# Altium schematic sheet 2 power.SchDoc: =GlobalProjectName
size A4; DocumentNumber: 2; SheetNumber: 2; SheetTotal: 5; PageSetup: Record=PageOptions|CenterHorizontal=True|CenterVertical=True|PrintScale=1.00|XCorrection=1.00|YCorrection=1.00|PrintKind=1|BorderSize=5000000|LeftOffset=0|BottomOffset=0|Orientation=2|PaperLength=1000|PaperWidth=1000|Scale=100|PaperSource=15|PrintQuality=1200|MediaType=1|DitherType=10|PaperKind=A3|PrintScaleMode=1; Weight: -; ScaleFactor: -
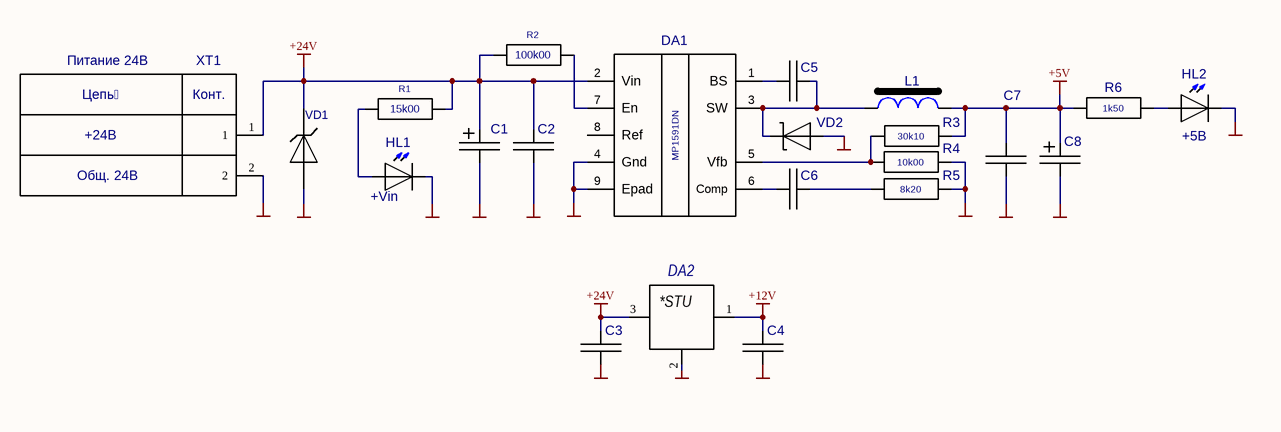
[diagram p0: 2 power.SchDoc]

## Parts
C1  22.0x35V  [TC7343-D]  (value not drawn)
C2  C0603  [0603_CAP]  (value not drawn)
C3  C0603  [0603_CAP]  (value not drawn)
C4  C0603  [0603_CAP]  (value not drawn)
C5  C0603  [0603_CAP]  (value not drawn)
C6  C0603  [0603_CAP]  (value not drawn)
C7  C0603  [0603_CAP]  (value not drawn)
C8  100.0x16V  [TC7343-D]  (value not drawn)
DA1  MP1591DN  [HSOP8]
DA2  L78L12ABUTR  [SOT-89]  (value not drawn)
HL1  KP-2012SYC  [KP-2012_YEL]  (value not drawn)
HL2  KP-2012MGC  [KP-2012_GRN]  (value not drawn)
L1  22µH CDRH124NP-220MC  [CDRH124]  (value not drawn)
R1  15k00  [0603_RES]
R2  100k00  [0603_RES]
R3  value 30k10  [0603_RES]  (hidden comment: R0603)
R4  value 10k00  [0603_RES]  (hidden comment: R0603)
R5  value 8k20  [0603_RES]  (hidden comment: R0603)
R6  value 1k50  [0603_RES]  (hidden comment: R0603)
VD1  P1.5KE24A  [DO-201AD]  (value not drawn)
VD2  STPS3L60U  [SMB-STPS3L60U]  (value not drawn)
XT1  XY301VA-5.0-2P-12  [301-021-12]  (value not drawn)  (parts A,B of 2)

## Nets
+5V: C7.1 C8.1 L1.2 R3.2 R6.1
+12V: C4.1 DA2.1(Out)
+24V: C1.1 C2.1 C3.1 DA1.2(Vin) DA2.3(In) R1.2 R2.1 VD1.2(C) XT1.1
GND: C1.2 C2.2 C3.2 C4.2 C7.2 C8.2 DA1.4(Gnd) DA1.9(Epad) DA2.2(GND) HL1.2(K) HL2.2(K) R4.2 R5.2 VD1.1(A) VD2.1(A) XT1.2
NetC5_1: C5.1 DA1.1(BS)
NetC5_2: C5.2 DA1.3(SW) L1.1 VD2.2(K)
NetC6_1: C6.1 DA1.6(Comp)
NetC6_2: C6.2 R5.1
NetDA1_5: DA1.5(Vfb) R3.1 R4.1
NetDA1_7: DA1.7(En) R2.2
NetHL1_1: HL1.1(A) R1.1
NetHL2_1: HL2.1(A) R6.2

Not connected (* = marked no-connect by the designer): DA1 8(Ref)

## Notes on the sheet
- Питание 24В
- XT1
- +24B
- Цепь
- (near XT1) Конт.
- (near HL2) +5В
- Общ. 24B
- (near HL1) +Vin
- Title
- Size:
- Date:
- A4
- Number:
- Time:
- Revision:
- Sheet
- of
- File:
- (in symbol L78L12ABUTR) *STU

## Library data of the parts
C1 = TC6032-D: Value: 22.0x35V
C2-C4 C7 = C0603: Value: µ10x50V X7R
C5 = C0603: Value: 10nFx50V X7R
C6 = C0603: Value: 1n8x50V X7R
C8 = TC7343-D: Value: 100.0x16V
DA2 = L78L12ABUTR: ID: 19; Input Voltage: +8.5…30V; Output Current: 100mA; Output Voltage: +12V; RMS Noise: 40uV; Temperature Stability: ±4%; Line Regulation: 200mV; Value: L78L12ABUTR; Published: 13.08.2015; Publisher: Andrew Danich; Type: Микросхема; Part Number: L78L12ABUTR
HL1 HL2 = KP-2012
  HL1: Value: KP-2012SYC
  HL2: Value: KP-2012MGC
L1 = CDRH124: Value: 22µH CDRH124NP-220MC
R1 R2 = R0603
  R1: Value: 15k00
  R2: Value: 100k00
VD1 = P1.5KE_X_(A): Value: P1.5KE24A
XT1 = 301-021-12: Клеммник винтовой, 2-контактный, 5мм, прямой; Value: XY301VA-5.0-2P-12
DA1 = MP1591DN: Value: MP1591DN
VD2 = STPS3L60U: Value: STPS3L60U